# EAGLE design EXT_4N (EAGLE 6.4)
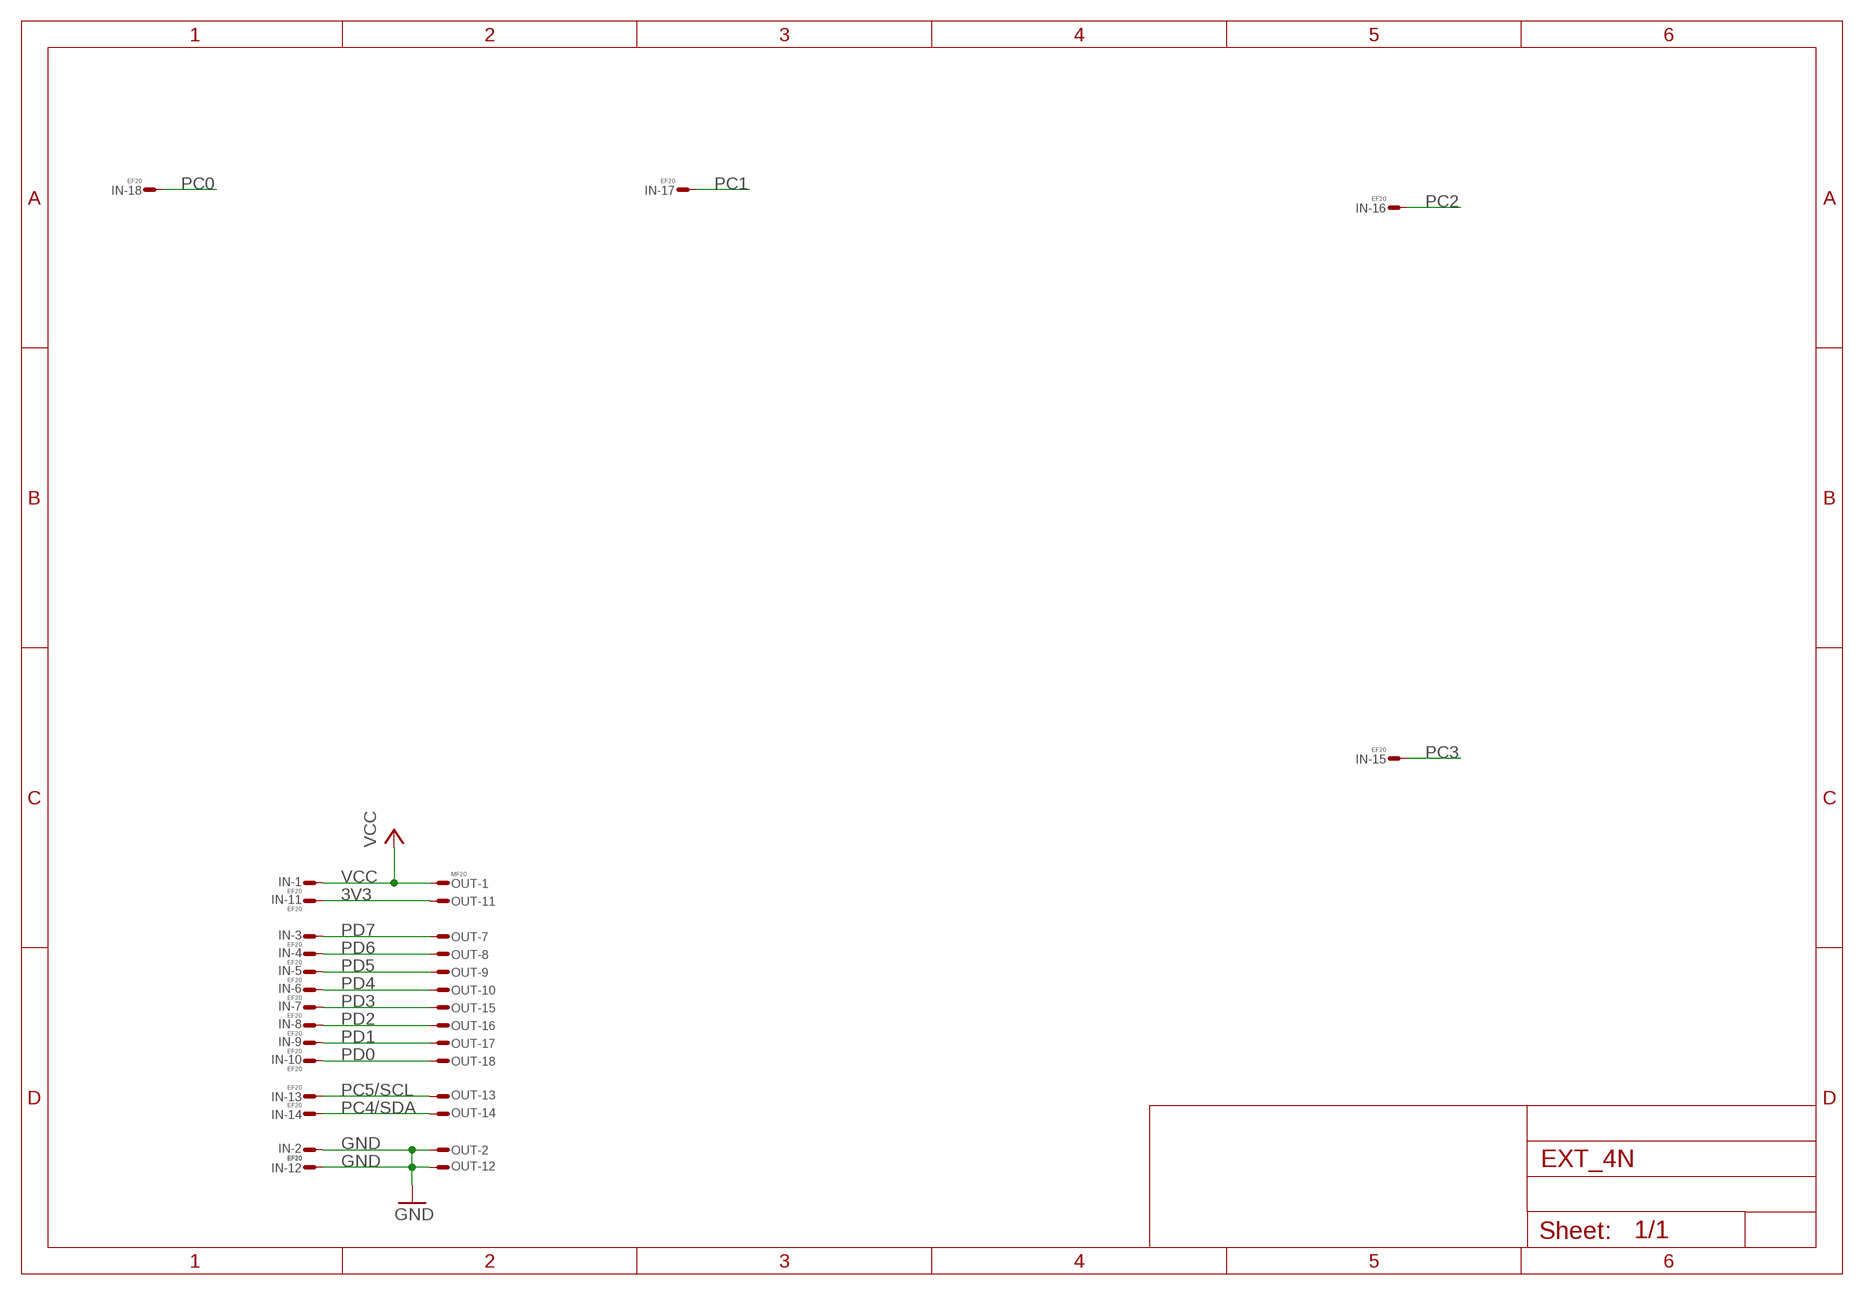
[diagram p0: schematic, sheet 1]

## Parts
IN  EF20  FE20ELS  [FE10-2WS]
OUT  MF20  ML20LSE  [ML20LS]

## Nets
3V3: IN.P$11 OUT.P$11
GND: IN.P$2 IN.P$12 OUT.P$2 OUT.P$12
PC0: IN.P$18
PC1: IN.P$17
PC2: IN.P$16
PC3: IN.P$15
PC4/SDA: IN.P$14 OUT.P$14
PC5/SCL: IN.P$13 OUT.P$13
PD0: IN.P$10 OUT.P$18
PD1: IN.P$9 OUT.P$17
PD2: IN.P$8 OUT.P$16
PD3: IN.P$7 OUT.P$15
PD4: IN.P$6 OUT.P$10
PD5: IN.P$5 OUT.P$9
PD6: IN.P$4 OUT.P$8
PD7: IN.P$3 OUT.P$7
VCC: IN.P$1 OUT.P$1
Unconnected: IN.P$19 IN.P$20 OUT.P$3 OUT.P$4 OUT.P$5 OUT.P$6 OUT.P$19 OUT.P$20

## Library data of the parts
IN = Conn:FE20E
OUT = Conn:ML20?E: HARTING

## Board
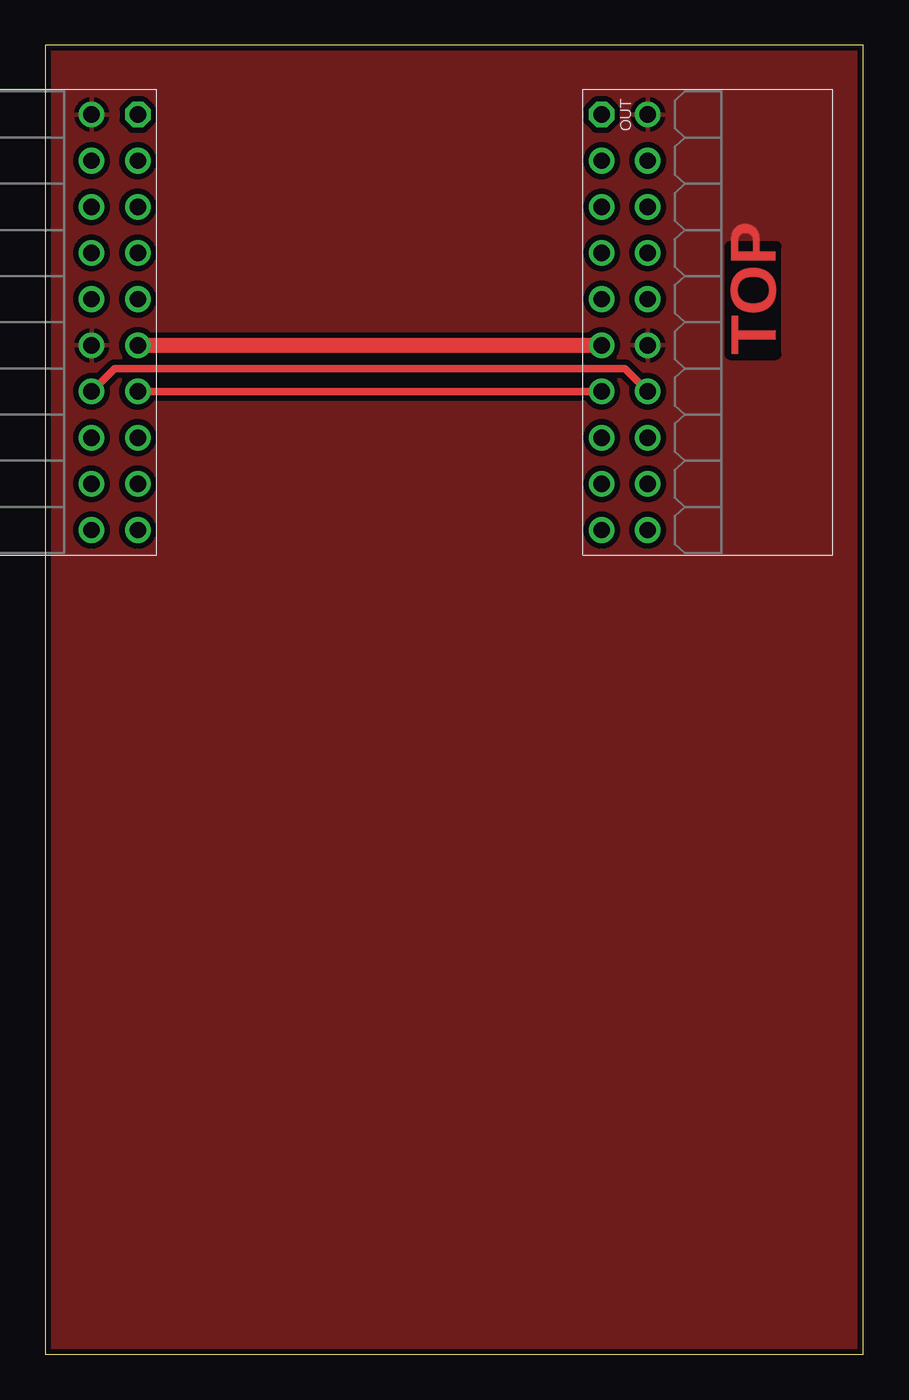
[diagram p1: board, top side]
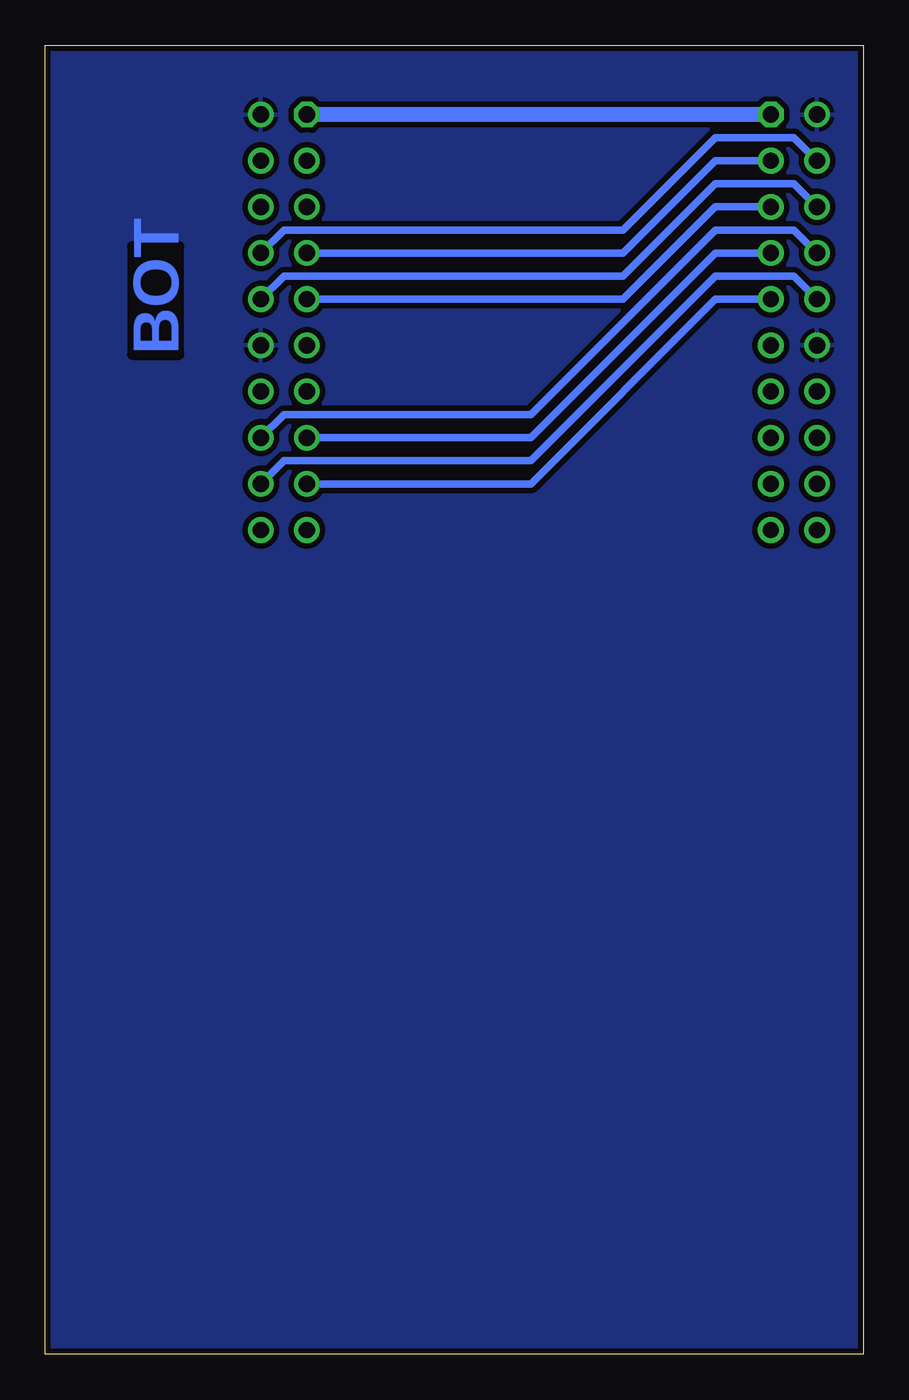
[diagram p2: board, bottom side, seen from below]

Size 45 x 72 mm. Coordinates in mm from the lower left corner, seen from the top.
Outline: 0,0 45,0 45,72 0,72 0,0
Copper layers (1*16): Top 0.035mm / dielectric 1.5mm / Bottom 0.035mm
Design rules "default *": minimum track width 10mil, minimum drill 10mil, track to track 12mil, track to pad 12mil, pad to pad 12mil, via to via 12mil, smd to smd 12mil, copper to edge 12mil, drill to drill 8mil, minimum pad ring 10mil, minimum via ring 8mil, stop-mask expansion 4mil, vias tented up to drill 0mil, thermal gap 10mil
tKeepout: area 0,0 to 45,2; area 0,70 to 45,72

### Footprints (pad centres in the part's own frame; a part is rotated, then mirrored left to right if it is on the bottom)
FE10-2WS = drill 0.9 octagon: P$1 -11.43,1.27 | drill 0.9: P$2 -11.43,-1.27; P$3 -8.89,1.27; P$4 -8.89,-1.27; P$5 -6.35,1.27; P$6 -6.35,-1.27; P$7 -3.81,1.27; P$8 -3.81,-1.27; P$9 -1.27,1.27; P$10 -1.27,-1.27; P$11 1.27,1.27; P$12 1.27,-1.27; P$13 3.81,1.27; P$14 3.81,-1.27; P$15 6.35,1.27; P$16 6.35,-1.27; P$17 8.89,1.27; P$18 8.89,-1.27; P$19 11.43,1.27; P$20 11.43,-1.27
ML20LS = drill 0.9 octagon: P$1 -11.43,-1.27 | drill 0.9: P$2 -11.43,1.27; P$3 -8.89,-1.27; P$4 -8.89,1.27; P$5 -6.35,-1.27; P$6 -6.35,1.27; P$7 -3.81,-1.27; P$8 -3.81,1.27; P$9 -1.27,-1.27; P$10 -1.27,1.27; P$11 1.27,-1.27; P$12 1.27,1.27; P$13 3.81,-1.27; P$14 3.81,1.27; P$15 6.35,-1.27; P$16 6.35,1.27; P$17 8.89,-1.27; P$18 8.89,1.27; P$19 11.43,-1.27; P$20 11.43,1.27

### Placement (x,y rotation side)
IN  3.81,56.77 270 top
OUT  31.88,56.77 270 top

### Tracks (layer width: path | path; a pad name or v marks a point on that pad's centre or on a via)
3V3
  Top 0.813: IN.P$11 OUT.P$11
GND
  pour Bottom: 0,0 44.91,0 44.91,71.88 0,71.88
  pour Top: 0,0 45.03,0 45.03,71.88 0,71.88
PC4/SDA
  Top 0.406: IN.P$14 3.81,54.23 31.88,54.23 OUT.P$14
PC5/SCL
  Top 0.406: IN.P$13 OUT.P$13
PD0
  Bottom 0.406: IN.P$10 3.81,59.31 8.13,59.31 18.29,49.15 31.88,49.15 OUT.P$18
PD1
  Bottom 0.406: IN.P$9 8.13,58.04 18.29,47.88 OUT.P$17
PD2
  Bottom 0.406: IN.P$8 3.81,61.85 8.13,61.85 18.29,51.69 31.88,51.69 OUT.P$16
PD3
  Bottom 0.406: IN.P$7 8.13,60.58 18.29,50.42 OUT.P$15
PD4
  Bottom 0.406: IN.P$6 3.81,64.39 8.13,64.39 13.21,59.31 31.88,59.31 OUT.P$10
PD5
  Bottom 0.406: IN.P$5 8.13,63.12 13.21,58.04 OUT.P$9
PD6
  Bottom 0.406: IN.P$4 3.81,66.93 8.13,66.93 13.21,61.85 31.88,61.85 OUT.P$8
PD7
  Bottom 0.406: IN.P$3 8.13,65.66 13.21,60.58 OUT.P$7
VCC
  Bottom 0.813: IN.P$1 OUT.P$1

### Text on the board
Top: TOP
Bottom: BOT